# EAGLE schematic belichtungsuhr (EAGLE 9.4.2)
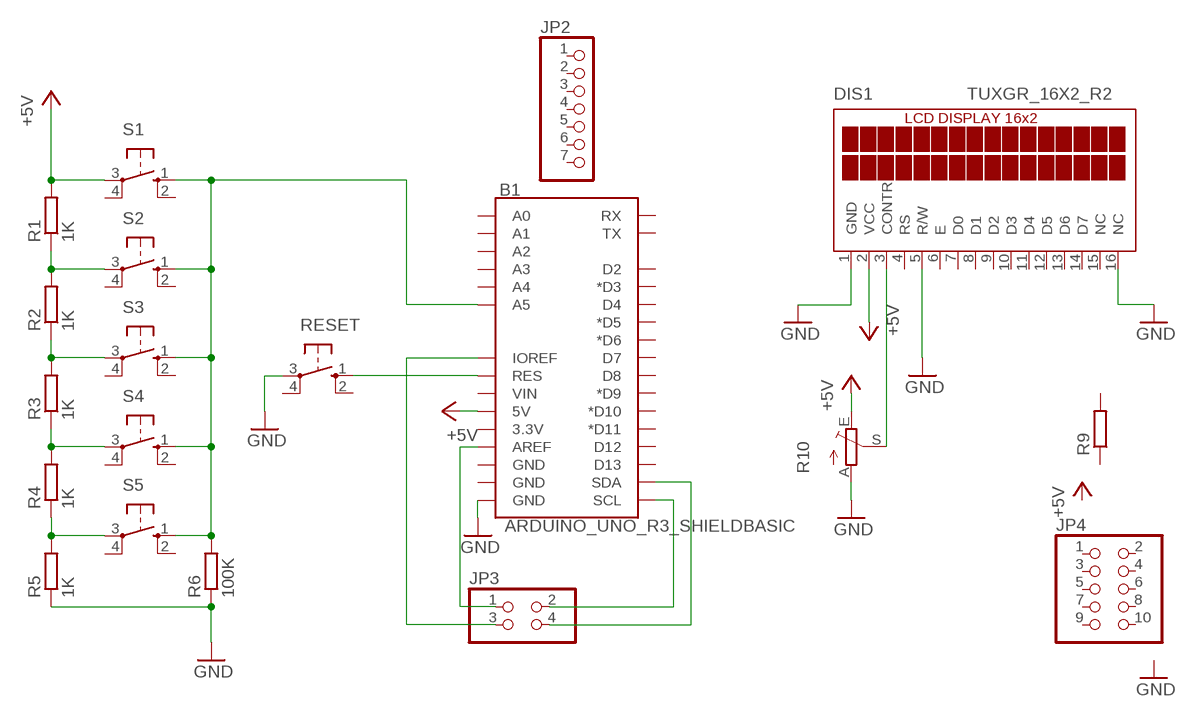
[diagram p0: schematic, sheet 1]

## Parts
B1  ARDUINO_UNO_R3_SHIELDBASIC  [UNO_R3_SHIELD]
DIS1  TUXGR_16X2_R2  [TUXGR_16X2_R2]
JP2  PINHD-1X7  [1X07]
JP3  PINHD-2X2  [2X02]
JP4  PINHD-2X5  [2X05]
R1  1K  R-EU_0204/7  [0204/7]
R2  1K  R-EU_0204/7  [0204/7]
R3  1K  R-EU_0204/7  [0204/7]
R4  1K  R-EU_0204/7  [0204/7]
R5  1K  R-EU_0204/7  [0204/7]
R6  100K  R-EU_0204/7  [0204/7]
R9  R-EU_0204/7  [0204/7]
R10  TRIM_EU-LI10  [LI10]
RESET  10-XX  [B3F-10XX]
S1  10-XX  [B3F-10XX]
S2  10-XX  [B3F-10XX]
S3  10-XX  [B3F-10XX]
S4  10-XX  [B3F-10XX]
S5  10-XX  [B3F-10XX]

## Nets
+5V: B1.5V DIS1.2(VCC) R1.2 R10.E S1.3(P)
GND: B1.GND@0(GND) DIS1.1(GND) DIS1.5(R/W) DIS1.16(NC) R5.1 R6.1 R10.A RESET.3(P)
N$1: R1.1 R2.2 S2.3(P)
N$2: R2.1 R3.2 S3.3(P)
N$3: R3.1 R4.2 S4.3(P)
N$4: R4.1 R5.2 S5.3(P)
N$5: B1.RES RESET.1(S)
N$6: B1.A5 R6.2 S1.1(S) S2.1(S) S3.1(S) S4.1(S) S5.1(S)
N$7: B1.AREF JP3.1
N$8: B1.IOREF JP3.3
N$9: B1.SCL JP3.2
N$10: B1.SDA JP3.4
N$11: DIS1.3(CONTR) R10.S
Unconnected: B1.3.3V B1.A0 B1.A1 B1.A2 B1.A3 B1.A4 B1.D2 B1.D3(*D3) B1.D4 B1.D5(*D5) B1.D6(*D6) B1.D7 B1.D8 B1.D9(*D9) B1.D10(*D10) B1.D11(*D11) B1.D12 B1.D13 B1.GND@1(GND) B1.GND@2(GND) B1.RX B1.TX B1.VIN DIS1.4(RS) DIS1.6(E) DIS1.7(D0) DIS1.8(D1) DIS1.9(D2) DIS1.10(D3) DIS1.11(D4) DIS1.12(D5) DIS1.13(D6) DIS1.14(D7) DIS1.15(NC) JP2.1 JP2.2 JP2.3 JP2.4 JP2.5 JP2.6 JP2.7 JP4.1 JP4.2 JP4.3 JP4.4 JP4.5 JP4.6 JP4.7 JP4.8 JP4.9 JP4.10 R9.1 R9.2 RESET.2(S1) RESET.4(P1) S1.2(S1) S1.4(P1) S2.2(S1) S2.4(P1) S3.2(S1) S3.4(P1) S4.2(S1) S4.4(P1) S5.2(S1) S5.4(P1)

## Library data of the parts
B1 = SparkFun-Boards:ARDUINO_UNO_R3_SHIELD: Arduino R3 Shield Footprint Shield form compatible with the Arduino Uno R3. SparkFun Products: MG2639 Cellular Shield <https://www.sparkfun.com/products/13120> MIDI Shield <https://www.sparkfun.com/products/12898> R3 Stackable Headers Kit <https://www.sparkfun.com/products/11417>
DIS1 = display-lcd:TUXGR_16X2_R2: Tuxgraphics LCD display 16x2 characters reflective, without background light Source: tuxgr_12x2_r2.pdf; OC_FARNELL: unknown; OC_NEWARK: unknown
JP2 = pinhead:PINHD-1X7: PIN HEADER
JP3 = pinhead:PINHD-2X2: PIN HEADER
JP4 = pinhead:PINHD-2X5: PIN HEADER
R1-R6 R9 = rcl:R-EU_: RESISTOR, European symbol; SPICEPREFIX: R
R10 = pot:TRIM_EU-: POTENTIOMETER
RESET S1-S5 = switch-omron:10-XX: OMRON SWITCH; MPN: B3F-1000; OC_FARNELL: 176432; OC_NEWARK: 36M3542